# EAGLE design nClon_001 (EAGLE 6.5.0)
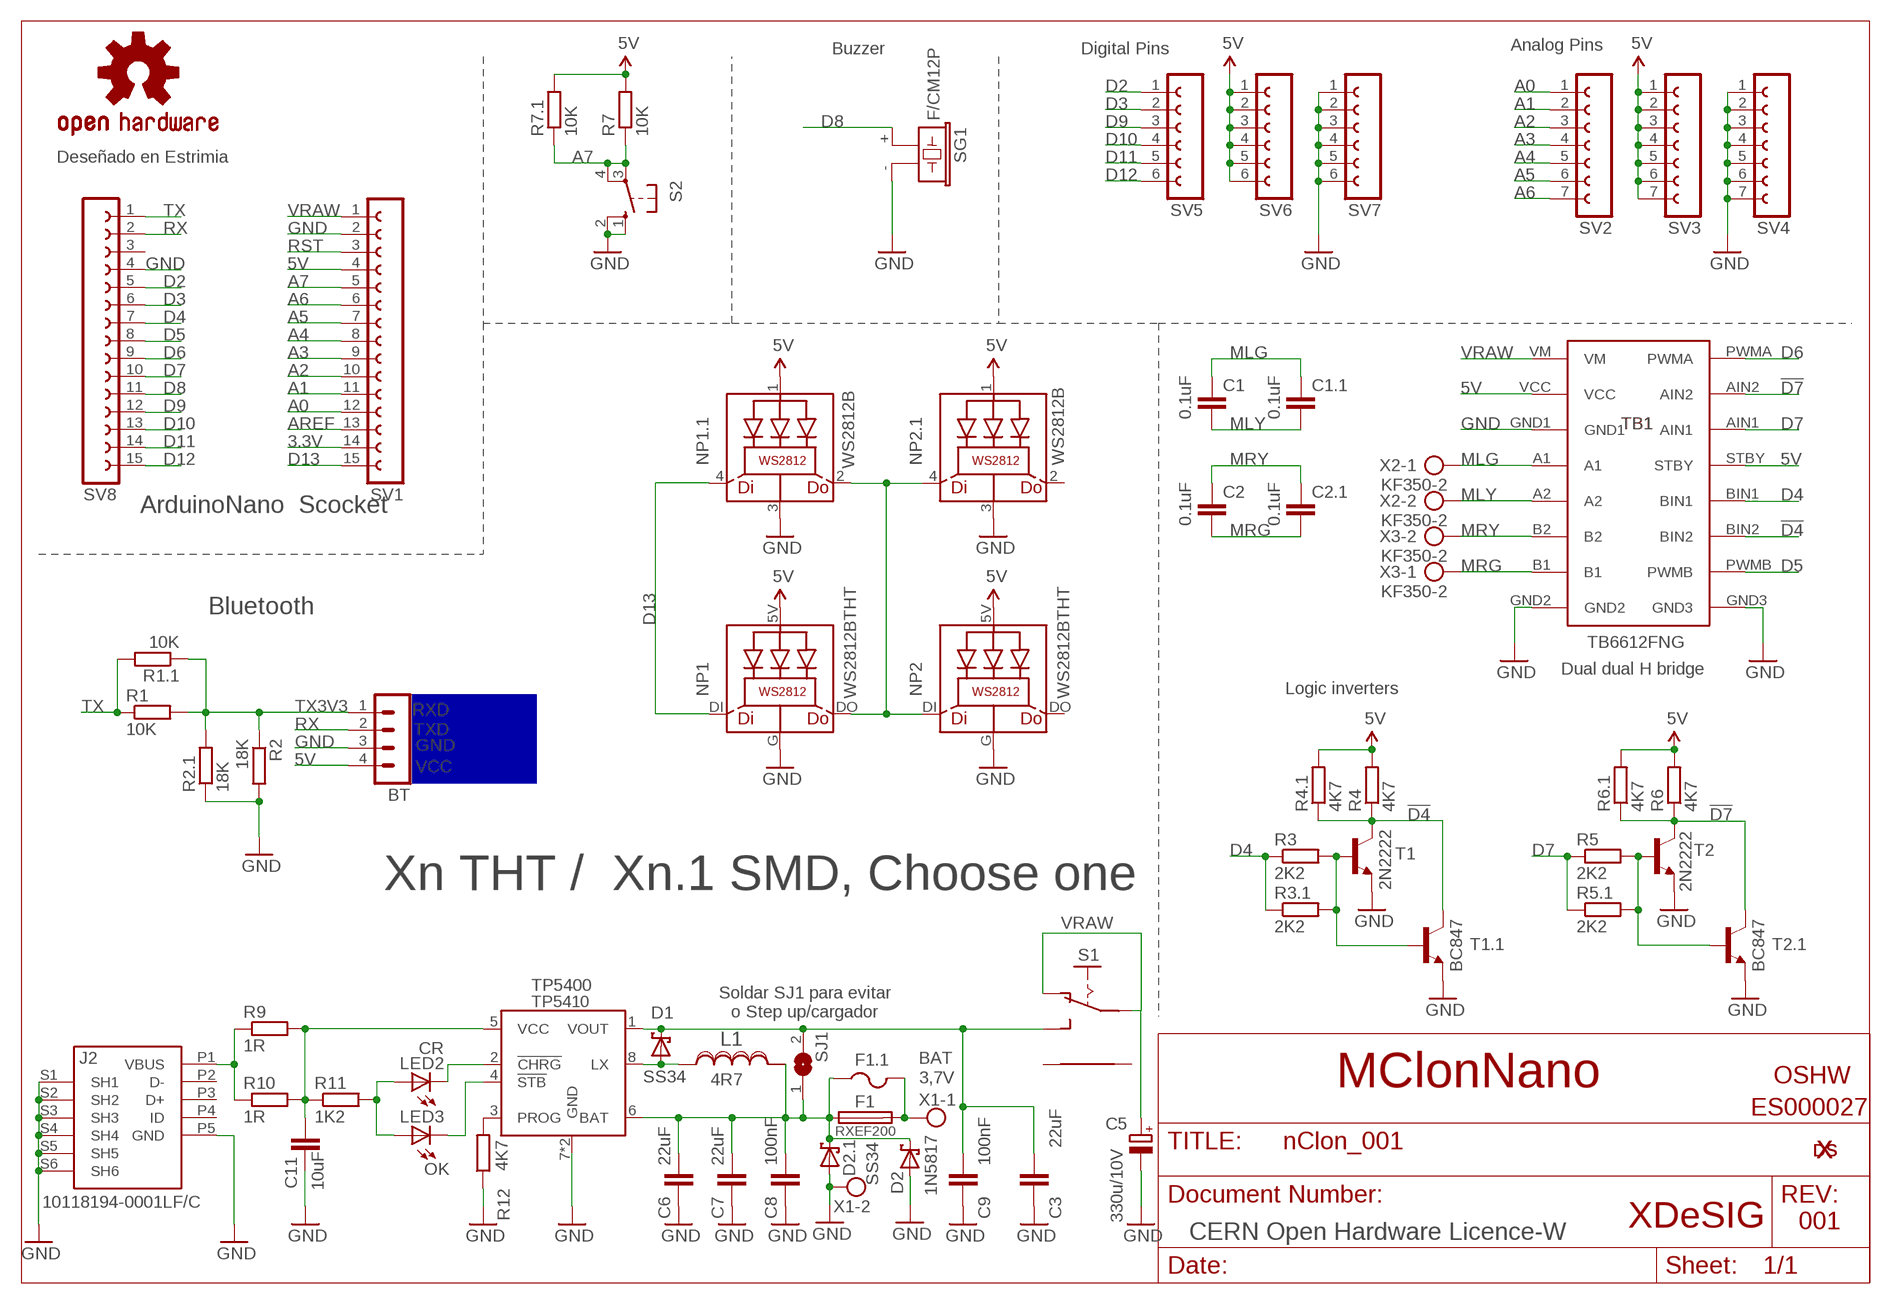
[diagram p0: schematic, sheet 1]

## Parts
BT  MA04-1  [MA04-1]
C1  0.1uF  C-EU050-024X044  [C050-024X044]
C1.1  0.1uF  C-EUC1206  [C1206]
C2  0.1uF  C-EU050-024X044  [C050-024X044]
C2.1  0.1uF  C-EUC1206  [C1206]
C3  22uF  C-EUC1206  [C1206]
C5  330u/10V  CPOL-EUE2.5-6  [E2,5-6]
C6  22uF  C-EUC1206  [C1206]
C7  22uF  C-EUC1206  [C1206]
C8  100nF  C-EUC1206  [C1206]
C9  100nF  C-EUC1206  [C1206]
C11  10uF  C-EUC1206  [C1206]
D1  SS34  DIODE_SCHOTTKY-DIODESMA  [DIODE_SMA]
D2  1N5817  SCHOTTKY-DIODEDO35-7  [DO35-7]
D2.1  SS34  DIODE_SCHOTTKY-DIODESMA  [DIODE_SMA]
F1  RXEF200  FUSETE5  [TE5]
F1.1  MF-NSMF200  PTCFUSE-1812  [1812]
J2  10118194-0001LF/C  SMARTPRJ_MYCON2_USB-MINI-B  [SMARTPRJ_CON2_USB_MICRO_B_AT]
L1  4R7  SRN6045-330M6045  [SRN6045]
LED2  CR  LEDCHIPLED_0805  [CHIPLED_0805]
LED3  OK  LEDCHIPLED_0805  [CHIPLED_0805]
LOGO4  OSHW-LOGOS  [OSHW-LOGO-S]
NP1  WS2812BTHT  [NEOPIXEL5MM]
NP1.1  WS2812B  [5050-4]
NP2  WS2812BTHT  [NEOPIXEL5MM]
NP2.1  WS2812B  [5050-4]
R1  10K  R-EU_0204/7  [0204/7]
R1.1  10K  R-EU_R1206  [R1206]
R2  18K  R-EU_0204/7  [0204/7]
R2.1  18K  R-EU_R1206  [R1206]
R3  2K2  R-EU_0204/7  [0204/7]
R3.1  2K2  R-EU_R1206  [R1206]
R4  4K7  R-EU_0204/7  [0204/7]
R4.1  4K7  R-EU_R1206  [R1206]
R5  2K2  R-EU_0204/7  [0204/7]
R5.1  2K2  R-EU_R1206  [R1206]
R6  4K7  R-EU_0204/7  [0204/7]
R6.1  4K7  R-EU_R1206  [R1206]
R7  10K  R-EU_0204/7  [0204/7]
R7.1  10K  R-EU_R1206  [R1206]
R9  1R  R-EU_M1206  [M1206]
R10  1R  R-EU_M1206  [M1206]
R11  1K2  R-EU_R1206  [R1206]
R12  4K7  R-EU_R1206  [R1206]
S1  ESCORNA_SK12F14D  [ESCORNA_SK-12D07]
S2  10-XX  [B3F-10XX]
SG1  F/CM12P  [F/CM12P]
SJ1  JUMPER_SJW  [JUMPER_SJW]
SV1  CON-LSTA_FE15-1  [CON-LSTA_FE15]
SV2  FE07-1  [FE07]
SV3  FE07-1  [FE07]
SV4  FE07-1  [FE07]
SV5  FE06-1  [FE06]
SV6  FE06-1  [FE06]
SV7  FE06-1  [FE06]
SV8  CON-LSTA_FE15-1  [CON-LSTA_FE15]
T1  2N2222  [TO92-EBC-OVAL]
T1.1  BC847  [SOT23]
T2  2N2222  [TO92-EBC-OVAL]
T2.1  BC847  [SOT23]
TB1  TB6612FNG  [TB6612FNG]
U1  TP5400  [ESOP8]
U$7  OSHW  [OSHW]
U$8  XDESIG5MM  [XDESIG_CU]
U$18  XDESIG21  [XDESIG]
U$19  XDESIG5MM  [XDESIG_CU]
X1  KF350-2  AK550/2  [AK550/2]
X2  KF350-2  AK550/2  [AK550/2]
X3  KF350-2  AK550/2  [AK550/2]

## Nets
3.3V: SV1.14
5V: BT.4 NP1.1.1(LEDVDD) NP1.5V(LEDVDD) NP2.1.1(LEDVDD) NP2.5V(LEDVDD) R4.1.2 R4.2 R6.1.2 R6.2 R7.1.2 R7.2 SV1.4 SV3.1 SV3.2 SV3.3 SV3.4 SV3.5 SV3.6 SV3.7 SV6.1 SV6.2 SV6.3 SV6.4 SV6.5 SV6.6 TB1.STBY TB1.VCC
!D4: R4.1 R4.1.1 T1.1.3(C) T1.C TB1.BIN2
!D7: R6.1 R6.1.1 T2.1.3(C) T2.C TB1.AIN2
A0: SV1.12 SV2.1
A1: SV1.11 SV2.2
A2: SV1.10 SV2.3
A3: SV1.9 SV2.4
A4: SV1.8 SV2.5
A5: SV1.7 SV2.6
A6: SV1.6 SV2.7
A7: R7.1 R7.1.1 S2.3(P) S2.4(P1) SV1.5
AREF: SV1.13
BAT: C6.1 C7.1 C8.1 D2.1.C D2.C F1.1 F1.1.1 L1.1 SJ1.1 U1.6(BAT)
D2: SV5.1 SV8.5
D3: SV5.2 SV8.6
D4: R3.1 R3.1.1 SV8.7 TB1.BIN1
D5: SV8.8 TB1.PWMB
D6: SV8.9 TB1.PWMA
D7: R5.1 R5.1.1 SV8.10 TB1.AIN1
D8: SG1.+ SV8.11
D9: SV5.3 SV8.12
D10: SV5.4 SV8.13
D11: SV5.5 SV8.14
D12: SV5.6 SV8.15
D13: NP1.1.4(DI) NP1.DI SV1.15
GND: BT.3 C3.2 C5.- C6.2 C7.2 C8.2 C9.2 C11.2 D2.1.A D2.A J2.P5(GND) J2.S1(SH1) J2.S2(SH2) J2.S3(SH3) J2.S4(SH4) J2.S5(SH5) J2.S6(SH6) NP1.1.3(GND) NP1.G(GND) NP2.1.3(GND) NP2.G(GND) R2.1.1 R2.2 R12.1 S2.1(S) S2.2(S1) SG1.- SV1.2 SV4.1 SV4.2 SV4.3 SV4.4 SV4.5 SV4.6 SV4.7 SV7.1 SV7.2 SV7.3 SV7.4 SV7.5 SV7.6 SV8.4 T1.1.2(E) T1.E T2.1.2(E) T2.E TB1.GND1 TB1.GND2 TB1.GND3 U1.7(GND) U1.9(GND) X1.2
MLG: C1.1 C1.1.1 TB1.A1 X2.1
MLY: C1.1.2 C1.2 TB1.A2 X2.2
MRG: C2.1.2 C2.2 TB1.B1 X3.1
MRY: C2.1 C2.1.1 TB1.B2 X3.2
N$1: R3.1.2 R3.2 T1.1.1(B) T1.B
N$2: F1.1.2 F1.2 X1.1
N$4: R5.1.2 R5.2 T2.1.1(B) T2.B
N$5: LED2.A LED3.A R11.2
N$6: LED2.C U1.2(!CHRG)
N$9: NP1.1.2(DO) NP1.DO NP2.1.4(DI) NP2.DI
N$12: D1.A L1.2 U1.8(LX)
N$15: LED3.C U1.4(!STB)
N$17: R12.2 U1.3(PROG)
RST: SV1.3
RX: BT.2 SV8.2
TX: R1.1 R1.1.2 SV8.1
TX3V3: BT.1 R1.1.1 R1.2 R2.1 R2.1.2
VBUS: J2.P1(VBUS) R9.1 R10.1
VCC: C3.1 C9.1 D1.C S1.P$3(S) SJ1.2 U1.1(VOUT)
VCH: C11.1 R9.2 R10.2 R11.1 U1.5(VCC)
VRAW: C5.+ S1.P$1(P) S1.P$2(O) SV1.1 TB1.VM
Unconnected: J2.P2(D-) J2.P3(D+) J2.P4(ID) NP2.1.2(DO) NP2.DO S1.P$4 S1.P$5 SV8.3

## Notes on the sheet
- Buzzer | Digital Pins | Analog Pins
- Deseñado en Estrimia
- ArduinoNano  Scocket
- Bluetooth
- Dual dual H bridge
- Logic inverters
- RXD
- TXD
- GND
- VCC
- Xn THT /  Xn.1 SMD, Choose one
- TP5400
- Soldar SJ1 para evitar
  o Step up/cargador
- TP5410
- 3,7V
- MClonNano
- ES000027
- XDeSIG | 001
- CERN Open Hardware Licence-W

## Library data of the parts
BT = con-lstb:MA04-1: PIN HEADER; OC_FARNELL: unknown; OC_NEWARK: unknown
C1 C1.1 C2 C2.1 C3 C6-C9 C11 = rcl:C-EU: CAPACITOR, European symbol
C5 = rcl:CPOL-EU: POLARIZED CAPACITOR, European symbol
D1 D2.1 = escorna_ELIB:DIODE_SCHOTTKY-DIODE: Schottky Diode
D2 = adafruit:SCHOTTKY-DIODE: Schottky Diode
F1 = fuse:FUSE: Fuse; OC_FARNELL: unknown; OC_NEWARK: unknown
F1.1 = adafruit:PTCFUSE: PTC fuses, resettable thermistors
J2 = cervus2.100:SMARTPRJ_MYCON2_USB-MINI-B
L1 = SRN6045-330M:SRN6045-330M: Fixed Inductors SMD; AVAILABILITY: Unavailable; DESCRIPTION: 33µH Semi-Shielded Wirewound Inductor 1.4A 188mOhm Max Nonstandard; MF: Bourns; MP: SRN6045-330M; PACKAGE: Nonstandard Bourns; PRICE: None
LED2 LED3 = adafruit:LED: LED OSRAM: - CHIPLED LG R971, LG N971, LY N971, LG Q971, LY Q971, LO R971, LY R971 LH N974, LH R974 LS Q976, LO Q976, LY Q976 LO Q996 - Hyper CHIPLED LW Q18S LB Q993, LB Q99A, LB R99A - SideLED LS A670, LO A670, LY A670, LG A670, LP A670 LB A673, LV A673, LT A673, LW A673 LH A674 LY A675 LS A676, LA A676, LO A676, LY A676, LW A676 LS A679, LY A679, LG A679 - Hyper Micro SIDELED® LS Y876, LA Y876, LO Y876, LY Y876 LT Y87S - SmartLED LW L88C, LW L88S LB L89C, LB L89S, LG L890 LS L89K, LO L89K, LY L89K LS L896, LA L896, LO L896, LY L896 - TOPLED LS T670, LO T670, LY T670, LG T670, LP T670 LSG T670, LSP T670, LSY T670, LOP T670, LYG T670 LG T671, LOG T671, LSG T671 LB T673, LV T673, LT T673, LW T673 LH T674 LS T676, LA T676, LO T676, LY T676, LB T676, LH T676, LSB T676, LW T676 LB T67C, LV T67C, LT T67C, LS T67K, LO T67K, LY T67K, LW E67C LS E67B, LA E67B, LO E67B, LY E67B, LB E67C, LV E67C, LT E67C LW T67C LS T679, LY T679, LG T679 LS T770, LO T770, LY T770, LG T770, LP T770 LB T773, LV T773, LT T773, LW T773 LH T774 LS E675, LA E675, LY E675, LS T675 LS T776, LA T776, LO T776, LY T776, LB T776 LHGB T686 LT T68C, LB T68C - Hyper Mini TOPLED® LB M676 - Mini TOPLED Santana® LG M470 LS M47K, LO M47K, LY M47K Source: http://www.osram.convergy.de/
LOGO4 = SparkFun-Aesthetics:OSHW-LOGO: Open Source Hardware Logo This logo indicates the piece of hardware it is found on incorporates a OSHW license and/or adheres to the definition of open source hardware found here: http://freedomdefined.org/OSHW
NP1 NP1.1 NP2 NP2.1 = adafruit:WS2812B
R1 R1.1 R2 R2.1 R3 R3.1 R4 R4.1 R5 R5.1 R6 R6.1 R7 R7.1 R9-R12 = rcl:R-EU_: RESISTOR, European symbol
S1 = Escorna_CPU_2_01:ESCORNA_SK12F14
S2 = switch-omron:10-XX: OMRON SWITCH; MPN: B3F-1000; OC_FARNELL: 176432; OC_NEWARK: 36M3542
SG1 = buzzer:F/CM12P: BUZZER Source: Buerklin; OC_FARNELL: unknown; OC_NEWARK: unknown
SJ1 = escorna_LBREscorna_CPU_2_10:JUMPER_SJ: SMD solder JUMPER
SV1 SV8 = escorna_LBREscorna_CPU_2_10:CON-LSTA_FE15-1: FEMALE HEADER; OC_FARNELL: unknown; OC_NEWARK: unknown
SV2-SV4 = con-lsta:FE07-1: FEMALE HEADER; OC_FARNELL: unknown; OC_NEWARK: unknown
SV5-SV7 = con-lsta:FE06-1: FEMALE HEADER; OC_FARNELL: unknown; OC_NEWARK: unknown
T1 T2 = adafruit:2N2222: NPN TRANSISTOR Big oval pads
T1.1 T2.1 = nxp_60:BC847: 45 V, 100 mA NPN general-purpose transistors NPN general-purpose transistor AAL Eindhoven MK
TB1 = mClonShield_000:TB6612FNG
U1 = TP5400:TP5400
U$7 = xdesig:OSHW
U$8 U$18 U$19 = xdesig:XDESIG
X1-X3 = con-ptr500:AK550/2: CONNECTOR; OC_FARNELL: unknown; OC_NEWARK: unknown

## Net classes
0 default: width 0.254 mm, drill 0.61 mm, clearance 0.254 mm
1 power: width 0.254 mm, drill 0.61 mm, clearance 0.254 mm

## Board
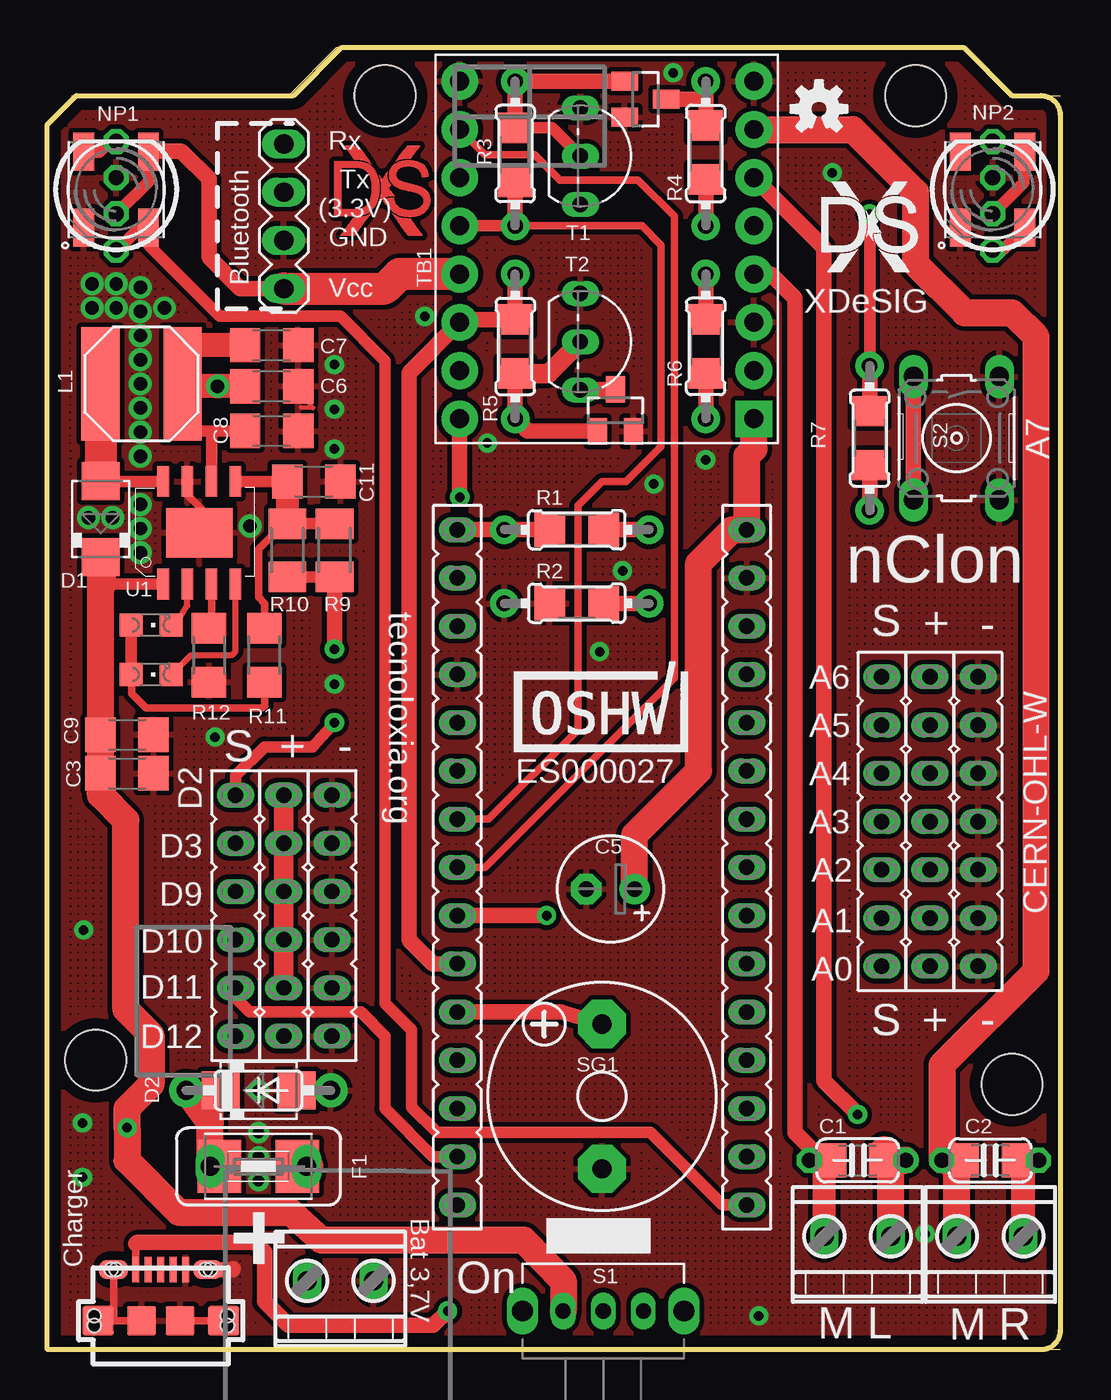
[diagram p1: board, top side]
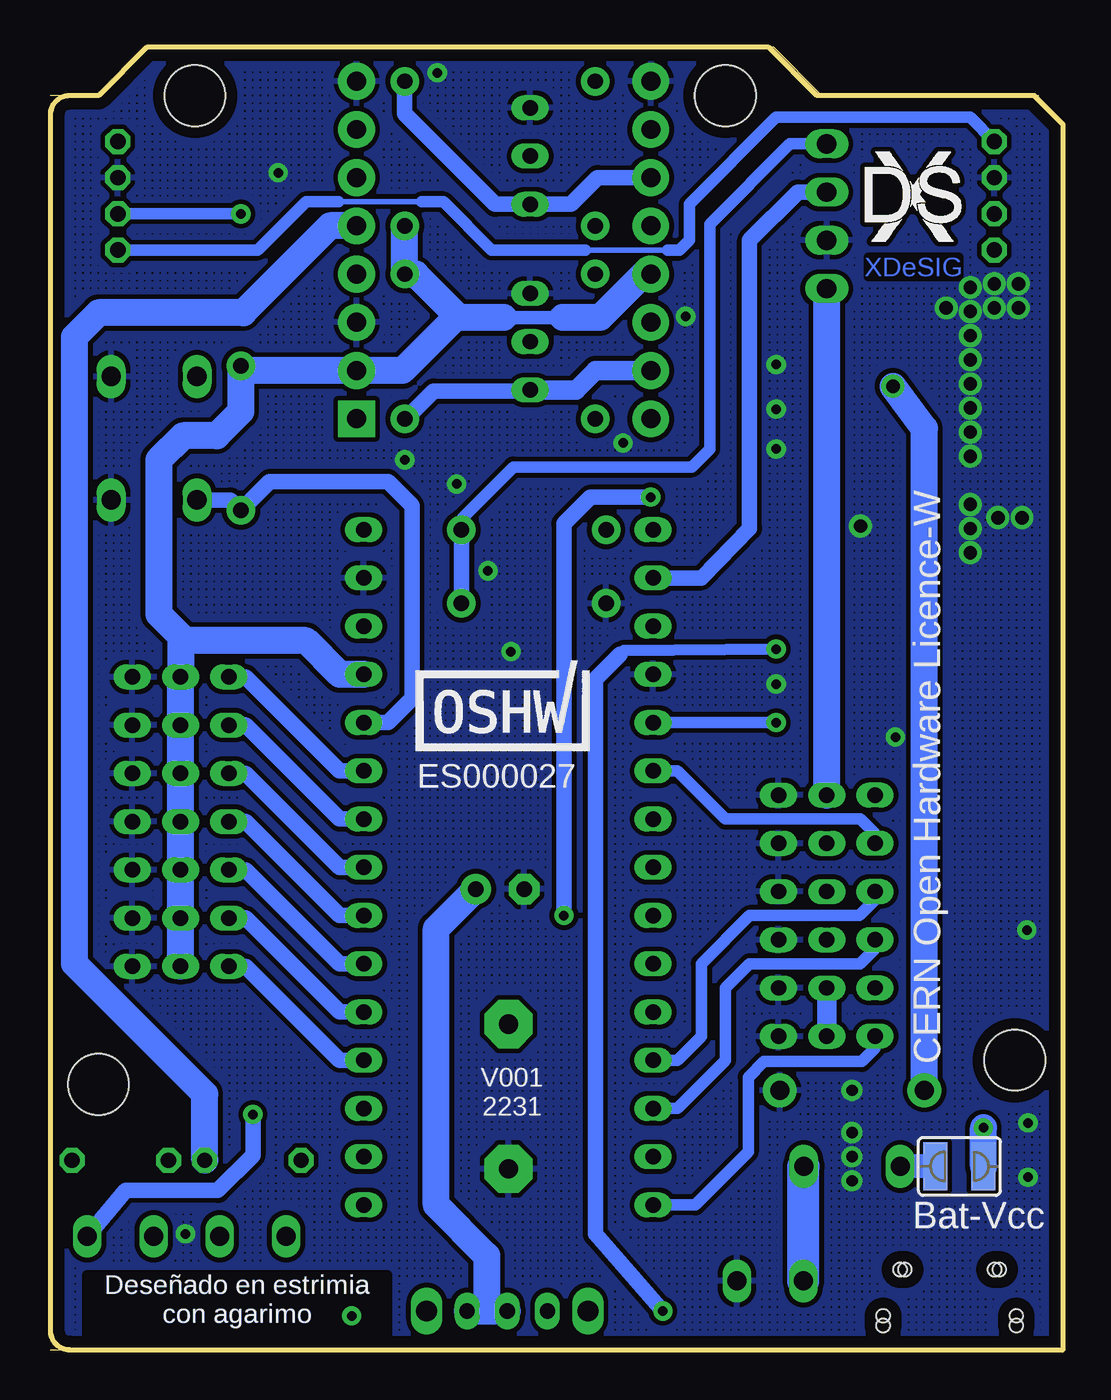
[diagram p2: board, bottom side, seen from below]

Size 53.34 x 68.58 mm. Coordinates in mm from the lower left corner, seen from the top.
Outline: 1.27,66.04 12.7,66.04 15.24,68.58 48.26,68.58
Outline: 50.8,66.04 53.34,66.04
Outline: 53.34,0 0,0
Outline: 48.26,68.58 15.49,68.58 12.95,66.04 1.52,66.04 0,64.52 0,0
Outline: 48.26,68.58 50.8,66.04
Outline: 50.8,66.04 52.34,66.04 arc-90 53.34,65.04 53.34,1 arc-90 52.34,0 0,0
Copper layers (1*16): Top 0.035mm / dielectric 1.5mm / Bottom 0.035mm
Design rules "default": minimum track width 10mil, minimum drill 22mil, track to track 10mil, track to pad 10mil, pad to pad 8mil, via to via 12mil, smd to smd 8mil, copper to edge 24mil, drill to drill 12mil, minimum pad ring 10mil, minimum via ring 10mil, stop-mask expansion 2mil, vias tented up to drill 30mil, thermal gap 10mil
Holes 3.2 mm at 17.78,66.04 45.72,66.04 2.54,15.24 50.8,13.97

### Footprints (pad centres in the part's own frame; a part is rotated, then mirrored left to right if it is on the bottom)
MA04-1 = drill 1.016 long: 1 -3.81,0; 2 -1.27,0; 3 1.27,0; 4 3.81,0
C050-024X044 = drill 0.813 octagon: 1 -2.54,0; 2 2.54,0
C1206 = smd 1.6 x 1.8: 1 -1.4,0; 2 1.4,0
E2,5-6 = drill 0.813 pad 1.6: + -1.27,0 | drill 0.813 pad 1.6 octagon: - 1.27,0
DIODE_SMA = smd 2 x 2: A 2,0; C -2,0
DO35-7 = drill 1 pad 1.778: A 3.81,0; C -3.81,0
TE5 = drill 1.016 long: 1 -2.54,0; 2 2.54,0
1812 = smd 2.286 x 2.794: 1 -2.046,0; 2 2.046,0
SMARTPRJ_CON2_USB_MICRO_B_AT = smd 0.406 x 1.346: P1 -1.321,2.692; P2 -0.66,2.692; P3 0,2.692; P4 0.66,2.692; P5 1.321,2.692 | smd 1.651 x 1.549: S1 -3.302,0; S2 3.302,0 | smd 1.524 x 1.016: S3 -2.489,2.692; S4 2.489,2.692 | smd 1.524 x 1.524: S5 -1.016,0; S6 1.016,0 | hole 0.7: -3.505,0.254; -3.505,-0.254; 3.505,0.254; 3.505,-0.254; -2.616,2.692; -2.362,2.692; 2.362,2.692; 2.616,2.692
SRN6045 = smd 2.007 x 5.994: 1 -2.159,0; 2 2.159,0
CHIPLED_0805 = smd 1.2 x 1.2: A 0,-1.05; C 0,1.05
NEOPIXEL5MM = drill 0.813 pad 1.27 octagon: 5V -1.27,0; DI -3.175,0; DO 2.54,0; G 0.635,0
5050-4 = smd 2 x 1.1: 1 -2,1.7; 2 -2,-1.7; 3 2,-1.7; 4 2,1.7
0204/7 = drill 0.813 pad 1.5: 1 -3.81,0; 2 3.81,0
R1206 = smd 1.6 x 1.803: 1 -1.422,0; 2 1.422,0
M1206 = smd 1.6 x 2: 1 -1.4,0; 2 1.4,0
ESCORNA_SK-12D07 = drill 0.8 long: P$1 0,0; P$2 2.115,0; P$3 -2.115,0 | drill 1.1 pad 1.422 long: P$4 -4.25,0; P$5 4.25,0
B3F-10XX = drill 1.016 long: 1 -3.251,2.261; 2 3.251,2.261; 3 -3.251,-2.261; 4 3.251,-2.261
F/CM12P = drill 1.016 pad 2.54 octagon: + 3.81,0; - -3.81,0
JUMPER_SJW = smd 1.27 x 2.54: 1 -1.27,0; 2 1.27,0
CON-LSTA_FE15 = drill 0.813 long: 1 -17.78,0; 2 -15.24,0; 3 -12.7,0; 4 -10.16,0; 5 -7.62,0; 6 -5.08,0; 7 -2.54,0; 8 0,0; 9 2.54,0; 10 5.08,0; 11 7.62,0; 12 10.16,0; 13 12.7,0; 14 15.24,0; 15 17.78,0
FE07 = drill 0.813 long: 1 -7.62,0; 2 -5.08,0; 3 -2.54,0; 4 0,0; 5 2.54,0; 6 5.08,0; 7 7.62,0
FE06 = drill 0.813 long: 1 -6.35,0; 2 -3.81,0; 3 -1.27,0; 4 1.27,0; 5 3.81,0; 6 6.35,0
TO92-EBC-OVAL = drill 0.813 long: B 0,-1.27; C 2.54,-1.27; E -2.54,-1.27
SOT23 = smd 1 x 1.4: 1 -0.95,-1.1; 2 0.95,-1.1; 3 0,1.1
TB6612FNG = drill 1 pad 1.93: A1 -7.62,-1.27; A2 -7.62,-3.81; AIN1 7.874,1.27; AIN2 7.874,3.81; B1 -7.62,-8.89; B2 -7.62,-6.35; BIN1 7.874,-3.81; BIN2 7.874,-6.35; GND1 -7.62,1.27; GND2 -7.62,-11.43; GND3 7.874,-11.43; PWMA 7.874,6.35; PWMB 7.874,-8.89; STBY 7.874,-1.27; VCC -7.62,3.81 | drill 1 pad 1.93 square: VM -7.62,6.35
ESOP8 = smd 1.61 x 0.61: 1 -2.54,1.905; 2 -2.54,0.635; 3 -2.54,-0.635; 4 -2.54,-1.905; 5 2.86,-1.905; 6 2.86,-0.635; 7 2.86,0.635; 8 2.86,1.905 | smd 2.62 x 3.51: 9 0.16,0.005
AK550/2 = drill 1 pad 1.5 long: 1 -1.75,0; 2 1.75,0

### Placement (x,y rotation side)
BT  12.45,59.69 270 top
C1  42.67,9.97 0 top
C1.1  42.67,9.97 0 top
C2  49.66,9.97 180 top
C2.1  49.66,9.97 180 top
C3  4.19,30.35 0 top
C5  29.65,24.26 180 top
C6  11.81,50.74 0 top
C7  11.81,52.9 0 top
C8  11.81,48.39 0 top
C9  4.19,32.38 0 top
C11  14.03,45.72 0 top
D1  2.79,43.75 90 top
D2  11.11,13.65 0 top
D2.1  11.11,13.65 0 top
F1  11.11,9.65 0 top
F1.1  11.11,9.65 0 top
J2  5.97,1.52 0 top
L1  4.95,50.86 180 top
LED2  5.46,38.16 270 top
LED3  5.46,35.56 270 top
LOGO4  40.64,65.34 0 top
NP1  3.62,61.09 90 top
NP1.1  3.62,61.09 270 top
NP2  49.78,61.09 90 top
NP2.1  49.78,61.09 270 top
R1  27.88,43.18 0 top
R1.1  27.88,43.18 180 top
R2  27.88,39.31 180 top
R2.1  27.88,39.31 0 top
R3  24.64,62.99 90 top
R3.1  24.64,62.93 90 top
R4  34.67,62.99 270 top
R4.1  34.67,63.06 270 top
R5  24.64,52.83 270 top
R5.1  24.64,52.83 270 top
R6  34.67,52.83 90 top
R6.1  34.67,52.83 90 top
R7  43.31,48.01 90 top
R7.1  43.31,48.01 90 top
R9  15.11,42.1 90 top
R10  12.64,42.1 90 top
R11  11.43,36.58 270 top
R12  8.51,36.58 90 top
S1  29.27,2.03 0 top
S2  47.88,48.01 270 top
SG1  29.21,13.34 90 top
SJ1  5.46,9.65 0 bottom
SV1  36.83,25.4 270 top
SV2  43.94,27.81 90 top
SV3  46.48,27.81 90 top
SV4  49.02,27.81 90 top
SV5  9.91,22.86 270 top
SV6  12.45,22.86 90 top
SV7  14.99,22.86 90 top
SV8  21.59,25.4 270 top
T1  29.34,62.87 270 top
T1.1  31.5,65.85 270 top
T2  29.34,53.09 270 top
T2.1  29.91,49.47 0 top
TB1  29.59,55.37 180 top
U1  8,42.86 90 top
U$2  OSHW  [OSHW]  29.02,33.34 0 bottom
U$7  29.65,33.27 0 top
U$8  15.11,58.67 0 top
U$18  10.41,58.36 0 bottom
U$19  10.41,58.36 0 bottom
U$21  XDESIG21  [XDESIG]  40.77,56.77 0 top
X1  15.43,3.62 0 top
X2  42.67,5.97 0 top
X3  49.66,5.97 0 top

### Tracks (layer width: path | path; a pad name or v marks a point on that pad's centre or on a via)
5V  (via drill 0.5)
  Top 0.61: R7.2 v43.31,59.82 | 51.45,63.06 NP2.1.1 51.44,63.04 51.44,61.47 NP2.5V | 5.33,63.07 NP1.1.1 5.32,61.52 NP1.5V
  Top 0.813: R4.1.2 R4.2 | R7.1.2 R7.2 | BT.4 10.16,55.88 8.51,57.53 8.51,61.66 7.05,63.12 5.35,63.12 NP1.1.1 | R6.1.2 R6.2
  Top 1.016: SV6.2 SV6.3 SV6.4 SV6.5 SV6.6
  Top 1.676: BT.4 17.78,55.88 18.54,56.64 TB1.STBY
  Bottom 0.254: 45.72,35.56 SV3.7
  Bottom 0.61: SV3.7 46.48,35.05 | v43.31,59.82 NP2.5V
  Bottom 0.7: 26.35,54.36 29.46,54.36
  Bottom 1.016: SV6.2 SV6.1
  Bottom 1.422: SV3.1 SV3.2 SV3.3 SV3.4 SV3.5 SV3.6 SV3.7 46.48,37.59 | SV1.4 38.1,35.56 39.88,37.34 46.23,37.34 46.48,37.59 | TB1.STBY 22.1,56.64 24.38,54.36 26.35,54.36 | SV6.6 BT.4 | R4.2 R6.2 34.1,56.64 31.81,54.36 | 29.46,54.36 31.81,54.36 | 31.81,54.36 32,54.36 34.8,51.56 TB1.VCC 43.05,51.56 R7.2 43.31,49.4 44.58,48.13 46.36,48.13 47.62,46.86 47.62,38.73 46.48,37.59
!D4
  Top 0.406: 34.48,65.85 34.67,66.04
  Top 0.813: R4.1.1 34.67,66.04 R4.1 | T1.1.3 34.48,65.85
  Bottom 0.813: TB1.BIN2 24.51,61.72 25.91,60.33 T1.C 29.91,60.33 34.67,65.09 R4.1
!D7
  Top 0.813: T2.1.3 28.09,50.57 T2.C | R6.1.1 R6.1
  Bottom 0.813: R6.1 34.61,49.02 33.15,50.48 28.13,50.48 T2.C
  Bottom 1.016: TB1.AIN2 24.64,51.56 25.65,50.55 T2.C
A0
  Bottom 0.813: SV1.12 38.1,15.24 43.05,20.19 SV2.1
A1
  Bottom 0.813: SV1.11 38.1,17.78 43.05,22.73 SV2.2
A2
  Bottom 0.813: SV1.10 38.1,20.32 43.05,25.27 SV2.3
A3
  Bottom 0.813: SV1.9 38.1,22.86 43.05,27.81 SV2.4
A4
  Bottom 0.813: SV1.8 38.1,25.4 43.05,30.35 SV2.5
A5
  Bottom 0.813: SV1.7 38.1,27.94 43.05,32.89 SV2.6
A6
  Bottom 0.813: SV1.6 38.1,30.48 43.05,35.43 SV2.7
A7
  Top 0.813: R7.1.1 R7.1 | S2.4 S2.3
  Bottom 0.406: SV1.5 36.45,33.02
  Bottom 0.813: S2.4 43.87,44.76 R7.1 41.78,45.72 35.56,45.72 34.29,44.45 34.29,34.29 35.56,33.02 36.45,33.02
BAT  (via drill 0.7)
  Top 0.254: 7.62,48.26 7.62,48.39 7.62,49.53 L1.1
  Top 0.406: 7.3,48.39 7.3,48.26
  Top 0.61: U1.6 8.64,48.26 8.51,48.39 | C8.1 8.51,48.39 | 8.51,48.39 7.62,48.39 7.3,48.39 7.18,48.39 7.11,48.32 | 7.11,49.48 7.25,49.61
  Top 1.27: C7.1 7.05,52.9 L1.1 6.98,50.74 6.98,49.72 7.24,49.47 7.25,49.61 7.3,50.74 v8.95,50.74 C6.1
  Top 1.422: F1.1.1 F1.1 8.57,11.94 | 8.57,11.94 D2.C | 8.57,11.94 8.57,12.67 D2.1.C
  Bottom 0.406: 7.3,48.51 7.62,48.51 7.62,48.39
  Bottom 1.27: SJ1.1 F1.1
  Bottom 1.422: D2.C 7.3,48.51 v8.95,50.74
D2  (via drill 0.5)
  Top 0.61: SV5.1 9.91,30.23 11.43,31.75 13.97,31.75 v15.11,33.02
  Bottom 0.61: v15.11,33.02 SV8.5
D3
  Bottom 0.61: SV5.2 9.91,27.18 10.67,27.94 17.78,27.94 20.32,30.48 SV8.6
D4
  Top 0.406: R3.1 31.31,59.18 32.32,58.17 32.32,47.56 30.48,45.72 29.21,45.72 27.94,44.45 27.94,32.64 23.24,27.94 SV8.7
  Top 0.61: R3.1 TB1.BIN1
  Top 0.813: R3.1.1 R3.1
D5
  Top 0.406: TB1.PWMB 23.05,62.93 25.65,62.93 26.99,61.59 31.12,61.59 33.02,59.69 33.02,35.37 23.05,25.4 SV8.8
D6  (via drill 0.5)
  Top 0.813: TB1.PWMA v21.72,44.9 | SV8.9 v26.29,22.86
  Bottom 0.813: v21.72,44.9 24.89,44.9 26.29,43.5 v26.29,22.86
D7
  Top 0.813: SV8.10 20.32,20.32 19.05,21.59 19.05,51.44 TB1.AIN1 21.87,54.25 24.13,54.25 | R5.1.1 24.13,54.25 | R5.1 24.64,54.76 24.13,54.25
D8
  Top 0.813: SV8.11 27.05,17.78 SG1.+
D9
  Bottom 0.61: SV8.12 20.32,15.24 19.05,16.51 19.05,20.32 16.51,22.86 10.73,22.86 9.91,23.69 SV5.3
D10
  Bottom 0.61: SV5.4 9.91,21.12 10.7,20.32 16.51,20.32 17.78,19.05 17.78,15.24 20.32,12.7 SV8.13
D11
  Top 0.61: SV5.5 9.91,18.52 10.65,17.78 16.51,17.78 17.78,16.51 17.78,12.7 20.32,10.16 SV8.14
D12
  Bottom 0.61: SV5.6 9.91,15.88 10.6,15.18 15.75,15.18 16.57,14.35 16.57,10.41 19.37,7.62 SV8.15
D13
  Top 0.61: NP1.DI 3.68,57.91 4.86,59.09 NP1.1.4 5.32,58.18 9.08,54.42 15.43,54.42 17.78,52.07 17.78,18.22 19.18,16.83 19.18,12.76 20.51,11.43 31.75,11.43 35.56,7.62 SV1.15
GND  (via drill 0.5, 0.6, 0.7)
  Top 0.254: 13.36,49.62 13.97,49.59 C6.2
  Top 0.406: 7.37,45.02 8.13,44.26 8.13,43.15 U1.9 | J2.S3 3.48,1.57 J2.S1 J2.S5 | J2.S6 J2.S2
  Top 0.813: J2.S4 9.74,4.22 9.78,4.25
  other vias: 46.23,6.1 8.83,32.26 19.88,54.42 23.18,47.75 15.11,51.88 15.11,49.53 15.11,47.43 32.96,67.25 41.34,61.98 29.08,36.77 30.29,41.02 31.94,45.59 34.67,46.86 15.11,35.05 1.84,9.08 1.84,11.94 1.91,22.1 4.89,50.86 4.89,52.13 4.89,53.4 4.89,49.59 4.89,48.32 4.89,47.05 4.89,54.67 3.62,54.86 2.35,54.86 2.35,56.13 3.62,56.13 4.89,55.94 6.16,54.86 11.11,8.89 11.11,10.16 11.11,11.43 11.11,13.65 4.89,44.51 4.89,43.24 4.89,41.97 3.43,43.81 2.16,43.81 10.67,43.37 37.47,1.78
  pour Top (hatched): 0,0 0,64.77 1.27,66.04 12.7,66.04 15.24,68.58 48.26,68.58 50.8,66.04 53.34,66.04 53.34,0
  pour Bottom (hatched): 0,0 0,66.04 12.7,66.04 15.24,68.58 48.26,68.58 50.8,66.04 53.34,66.04 53.34,0
MLG
  Top 0.813: TB1.A1 38.1,56.64 39.37,55.37 39.37,11.43 40.13,10.67 C1.1 C1.1.1
  Top 1.2: X2.1 40.92,9.75 C1.1
MLY
  Top 1.422: X2.2 44.42,9.75 44.64,9.97 | 44.64,9.97 C1.2 | C1.1.2 44.07,10.54 44.64,9.97
  Bottom 1.422: C1.2 45.21,13.46 52.07,20.32 52.07,53.34 50.8,54.61 43.18,54.61 38.61,59.18 TB1.A2
MRG
  Top 0.813: C2.1.2 C2.2
  Top 1.422: TB1.B1 42.42,64.26 45.72,60.96 45.72,57.2 48.31,54.61 50.8,54.61 52.07,53.34 52.07,19.94 47.12,14.99 C2.2 47.91,9.75 X3.1
MRY  (via drill 0.5)
  Top 0.813: X3.2 51.41,6.89 | TB1.B2 40.89,58.04 40.89,14.16 v42.67,12.38 | C2.1.1 C2.1
  Top 1.27: X3.2 51.41,9.75 C2.1
  Bottom 0.813: v42.67,12.38 42.67,10.23 44.52,8.38 49.38,8.38 X3.2
N$1
  Top 0.61: R3.1.2 26.58,64.35 T1.B 28.11,62.91
  Top 0.813: T1.1.1 R3.2 | R3.1.2 R3.2
  Top 1.422: R3.2
N$2
  Top 1.422: F1.2 F1.1.2
  Top 1.676: F1.2 13.68,9.65
  Bottom 1.676: X1.1 13.68,9.62 F1.2
N$4
  Top 0.406: 28.09,53.07 T2.B
  Top 0.813: T2.1.1 25.29,48.37 R5.2 R5.1.2
  Top 1.016: R5.1.2 26.39,51.41 T2.B
N$5
  Top 0.406: R11.2 11.43,33.91 11.3,33.78 5.21,33.78 4.45,34.54 4.45,35.53 LED3.A
  Top 0.61: LED2.A LED3.A 4.38,35.53
N$6
  Top 0.305: U1.2 7.37,39.18 6.86,38.35 LED2.C
N$9
  Top 0.406: 1.91,63.1 NP1.1.2
  Top 0.61: 51.45,59.12 NP2.1.4 50.31,57.91 NP2.DI | NP1.1.2 1.95,63.06 2.73,63.06 3.3,63.63 NP1.DO 3.62,63.9
  Bottom 0.28: 20.83,57.91 25.15,57.91 | 33.78,60.45 38.16,60.45
  Bottom 0.61: 25.15,57.91 30.1,57.91 32.64,60.45 33.78,60.45 | 38.16,60.45 39.88,60.45 42.42,57.91 NP2.DI | 20.83,57.91 20.19,57.91 19.69,58.42 19.69,60.33 15.11,64.9 4.89,64.9 NP1.DO
N$12
  Top 0.61: U1.8 2.82,45.72 D1.A
  Top 1.676: L1.2 D1.A
N$15
  Top 0.305: LED3.C 6.54,35.56 7.56,36.58 9.72,36.58 9.91,36.77 U1.4
N$17
  Top 0.406: U1.3 8.64,38 R12.2
RX
  Bottom 0.813: SV8.2 19.05,40.64 16.51,43.24 16.51,58.42 13.97,60.96 BT.2
TX
  Top 0.813: R1.1.2 R1.1 SV8.1
TX3V3
  Top 0.813: R2.1.2 R2.1 | R1.1.1 R1.2
  Bottom 0.61: BT.1 14.39,63.5 18.61,59.28 18.61,47.43 19.56,46.48 28.96,46.48 31.69,43.75 R1.2
  Bottom 0.813: R1.2 R2.1
VBUS  (via drill 0.5)
  Top 0.406: J2.P1 4.65,5.58
  Top 0.61: R10.1 R9.1
  Top 0.813: v15.11,36.89 R9.1 | 4.65,5.58 4.72,5.65 10.92,5.65 11.43,5.14 11.43,2.54 12.7,1.27 20.32,1.27 v21.08,2.03
  Bottom 0.61: 24.64,10.54 24.64,10.29 | v15.11,36.89 23.11,36.83 23.3,36.64
  Bottom 0.813: v21.08,2.03 24.64,6.1 24.64,10.54 24.64,35.31 23.3,36.64
VCC  (via drill 0.5)
  Top 0.406: 2.92,40.32 2.79,40.2
  Top 0.61: U1.1 2.92,40.32
  Top 1.422: 2.92,40.32 2.92,41.62 D1.C C9.1 | 2.79,29.21 4.13,27.88 4.13,17.91 5.46,16.57 5.46,13.97 4.19,12.7 v4.19,11.68 4.19,9.96 6.91,7.24 12.83,7.24 14.41,5.78 25.08,5.78 27.18,3.62 27.18,2.05 27.16,2.05 S1.P$3 | 2.79,29.21 C9.1 | C9.1 | 2.79,29.21 C3.1
  Bottom 1.422: SJ1.2 v4.19,11.68
VCH
  Top 0.305: 11.88,42.99 12.1,43.14 R10.2
  Top 0.406: R11.1 11.43,39.31 11.11,39.62 11.11,42.15 12.1,43.14
  Top 0.61: U1.5 11.62,45.72 C11.1 | R10.2 R9.2
  Top 1.2: R10.2 C11.1
VRAW
  Top 0.406: 37.08,48.9 TB1.VM
  Top 1.422: TB1.VM 37.21,47.43 36.83,47.05 SV1.1 36.07,43.18 34.29,41.4 34.29,30.48 30.93,27.11 C5.+
  Bottom 1.422: 30.35,2.03 30.35,4.95 33.02,7.62 33.02,22.16 C5.+ | 30.35,2.03 S1.P$2 | S1.P$1 30.35,2.03

### Text on the board
Bottom: XDeSIG | Deseñado en estrimia / con agarimo
tPlace: Rx | Tx / (3.3V) | GND | Bluetooth | Vcc | XDeSIG | A7 | nClon | tecnoloxia.org | S | + | - | A6 | CERN-OHL-W | A5 | S | + | - | D2 | A4 | ES000027 | A3 | D3 | A2 | D9 | A1 | D10 | A0 | D11 | S | + | - | D12 | Charger | + | Bat 3,7V | On | M L | M R
bPlace: ES000027 | CERN Open Hardware Licence-W | V001 / 2231 | Bat-Vcc | Deseñado en estrimia / con agarimo
tDocu: Attribution-ShareAlike 4.0 International (CC BY-SA 4.0) XDeSIG